# Altium schematic sheet Sheet_1_2024-05-18.schdoc
size 312 x 196 mm
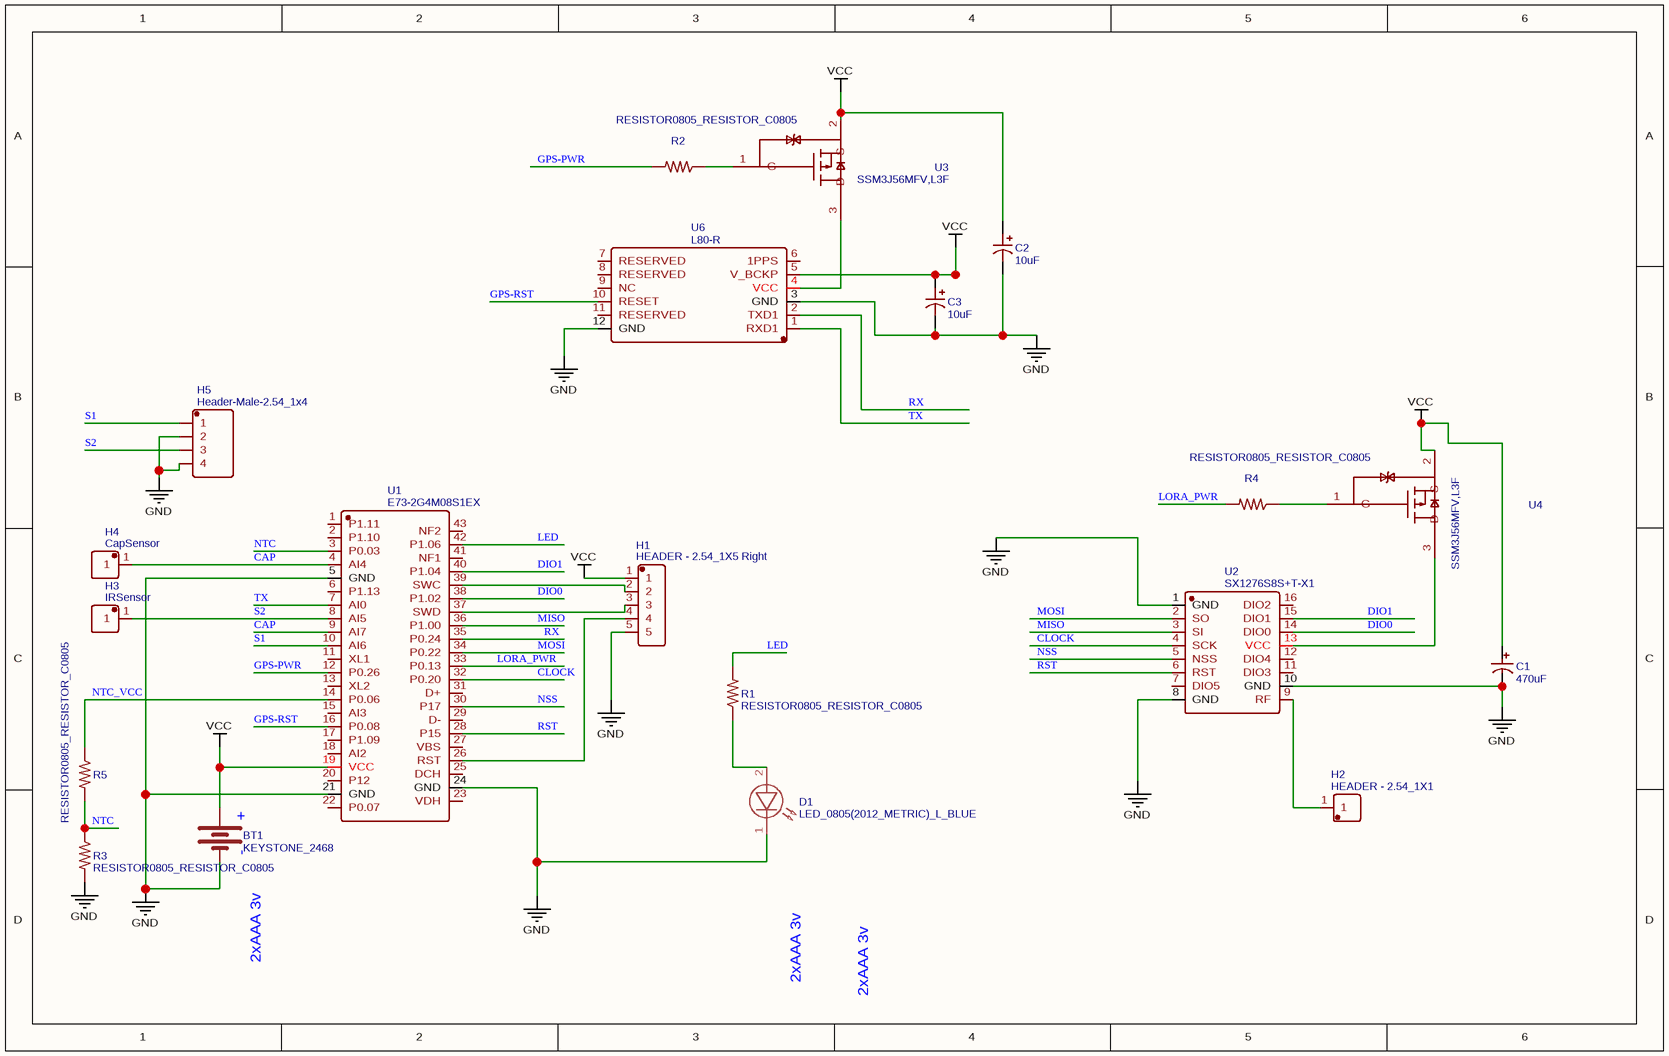
[diagram p0: Sheet_1_2024-05-18.schdoc]

## Parts
BT1  KEYSTONE_2468  [KEYSTONE_2468_2XAAA]
C1  470uF  [CAP-470UF-25V-CHONGX]
C2  10uF  [CAP-SMD_L3.5-W2.8-FD]
C3  10uF  [CAP-SMD_L3.5-W2.8-FD]
D1  LED_0805(2012_METRIC)_L_BLUE  [LED0805_BLUE-1]
H1  HEADER - 2.54_1X5 Right  [HEADER-HEADER-FEMALE-2.54_1X5]
H2  HEADER - 2.54_1X1  [HDR-M-2.54_1X1]
H3  IRSensor  [HDR-M-2.54_1X1]
H4  CapSensor  [HDR-M-2.54_1X1]
H5  Header-Male-2.54_1x4  [HDR-TH_4P-P2.54-V-M]
R1  RESISTOR0805_RESISTOR_C0805  [C0805]
R2  RESISTOR0805_RESISTOR_C0805  [C0805]
R3  RESISTOR0805_RESISTOR_C0805  [C0805]
R4  RESISTOR0805_RESISTOR_C0805  [C0805]
R5  RESISTOR0805_RESISTOR_C0805  [C0805]
U1  E73-2G4M08S1EX  [SMD-43_L18.0-W13.0-P1.27-E73-2G4M08S1E]
U2  SX1276S8S+T-X1  [WIRELM-SMD_SX1278S165SY-T-X1]
U3  SSM3J56MFV,L3F  [SOT-723_L1.2-W0.8-P0.80-LS1.2-BR]
U4  SSM3J56MFV,L3F  [SOT-723_L1.2-W0.8-P0.80-LS1.2-BR]
U6  L80-R  [GPSM-SMD_L80-R]

## Nets
GND: BT1.2(-) C1.2 C2.2 C3.2 D1.1(K) H1.5 H5.2 H5.4 R3.2 U1.5(GND) U1.21(GND) U1.24(GND) U2.1(GND) U2.8(GND) U2.10(GND) U6.3(GND) U6.12(GND)
VCC: BT1.1(+) C1.1 C2.1 C3.1 H1.1 U1.19(VCC) U3.2(S) U4.2(S) U6.5(V_BCKP)
CAP: H4.1 U1.4(AI4) U1.9(AI7)
CLOCK: U1.32(P0.20) U2.4(SCK)
DIO0: U1.38(P1.02) U2.14(DIO0)
DIO1: U1.40(P1.04) U2.15(DIO1)
GPS-PWR: R2.2 U1.12(P0.26)
GPS-RST: U1.16(P0.08) U6.10(RESET)
LED: R1.2 U1.42(P1.06)
LORA_PWR: R4.2 U1.33(P0.13)
MISO: U1.36(P1.00) U2.3(SI)
MOSI: U1.34(P0.22) U2.2(SO)
NSS: U1.30(P17) U2.5(NSS)
NTC: R3.1 R5.2 U1.3(P0.03)
NTC_VCC: R5.1 U1.14(P0.06)
RST: U1.28(P15) U2.6(RST)
RX: U1.35(P0.24) U6.2(TXD1)
S1: H5.1 U1.10(AI6)
S2: H3.1 H5.3 U1.8(AI5)
TX: U1.7(AI0) U6.1(RXD1)
NetD1_2: D1.2(A) R1.1
NetH1_2: H1.2 U1.39(SWC)
NetH1_3: H1.3 U1.37(SWD)
NetH1_4: H1.4 U1.26(RST)
NetH2_1: H2.1 U2.9(RF)
NetR2_1: R2.1 U3.1(G)
NetR4_1: R4.1 U4.1(G)
NetU2_13: U2.13(VCC) U4.3(D)
NetU3_3: U3.3(D) U6.4(VCC)

Not connected (* = marked no-connect by the designer): U1 1(P1.11) 2(P1.10) 6(P1.13) 11(XL1) 13(XL2) 15(AI3) 17(P1.09) 18(AI2) 20(P12) 22(P0.07) 23(VDH) 25(DCH) 27(VBS) 29(D-) 31(D+) 41(NF1) 43(NF2); U2 7(DIO5) 11(DIO3) 12(DIO4) 16(DIO2); U6 6(1PPS) 7(RESERVED) 8(RESERVED) 9(NC) 11(RESERVED)

## Notes on the sheet
- 2xAAA 3v
- (in symbol KEYSTONE_2468) 2xAAA 3v

## Library data of the parts
BT1 = KEYSTONE_2468: Manufacturer Part: 2468; Contributor: a.karnauh; Supplier: LCSC; Supplier Part: 2468; Manufacturer: Keystone; spicePre: B; spiceSymbolName: KEYSTONE_2468
C1 = 470uF: Manufacturer: ValuePro; Manufacturer Part: 470uF 10V白纸 13*25; nameAlias: Capacitance; Contributor: baongoc1234abcd; Supplier: LCSC; Supplier Part: C43814; JLCPCB Part Class: Extended Part; spicePre: C; spiceSymbolName: 470uF 10V ChongX
C2 C3 = 10uF: Manufacturer: CEC(振华新云); Manufacturer Part: CA45-B-10V-10UF-K; nameAlias: Value; Contributor: lcsc; Supplier: LCSC; Supplier Part: C2841149; spicePre: C; spiceSymbolName: CA45-B-10V-10UF-K
D1 = LED_0805(2012_METRIC)_L_BLUE: Contributor: Ілля Бондаренко; spicePre: D; spiceSymbolName: LED_0805(2012_METRIC)_L_BLUE
H1 = HEADER - 2.54_1X5 Right: Contributor: Jonathan Gainsford; spicePre: H; spiceSymbolName: HEADER - 2.54_1X5 Right
H2 = HEADER - 2.54_1X1: Contributor: ASP-29 Tech; Supplier: Private; spicePre: H; spiceSymbolName: HEADER - 2.54_1X1
H3 = IRSensor: Contributor: ASP-29 Tech; Supplier: Private; spicePre: H; spiceSymbolName: HEADER - 2.54_1X1
H4 = CapSensor: Contributor: ASP-29 Tech; Supplier: Private; spicePre: H; spiceSymbolName: HEADER - 2.54_1X1
H5 = Header-Male-2.54_1x4: Manufacturer: Ckmtw(灿科盟); Manufacturer Part: B-2100S04P-A110; Contributor: LCSC; Supplier: LCSC; Supplier Part: C124378; JLCPCB Part Class: Extended Part; spicePre: H; spiceSymbolName: Header-Male-2.54_1x4
R1 = RESISTOR0805_RESISTOR_C0805: Manufacturer: 2.2K; Package Display: No; timeStamp: 1474281357; spicePre: R; spiceSymbolName: RESISTOR0805_RESISTOR_C0805
R2 R4 R5 = RESISTOR0805_RESISTOR_C0805: Manufacturer: 10K; Package Display: No; timeStamp: 1474281357; spicePre: R; spiceSymbolName: RESISTOR0805_RESISTOR_C0805
R3 = RESISTOR0805_RESISTOR_C0805: Manufacturer: NTC 10K; Package Display: No; timeStamp: 1474281357; spicePre: R; spiceSymbolName: RESISTOR0805_RESISTOR_C0805
U1 = E73-2G4M08S1EX: Manufacturer: EBYTE(亿佰特); Contributor: lcsc; Supplier: LCSC; Supplier Part: C2903762; Manufacturer Part: E73-2G4M08S1EX; JLCPCB Part Class: Extended Part; spicePre: U; spiceSymbolName: E73-2G4M08S1EX
U2 = SX1276S8S+T-X1: Manufacturer: Vollgo(沃进); Contributor: LCSC; Supplier: LCSC; Supplier Part: C718834; Manufacturer Part: SX1276S8S+T-X1; JLCPCB Part Class: Extended Part; spicePre: U; spiceSymbolName: SX1276S8S+T-X1
U3 U4 = SSM3J56MFV,L3F: Manufacturer: TOSHIBA(东芝); Contributor: lcsc; Supplier: LCSC; Supplier Part: C5274157; Manufacturer Part: SSM3J56MFV,L3F; JLCPCB Part Class: Extended Part; spicePre: U; spiceSymbolName: SSM3J56MFV,L3F
U6 = L80-R: Manufacturer: Quectel(移远); Contributor: LCSC; Supplier: LCSC; Supplier Part: C188357; Manufacturer Part: L80-R; JLCPCB Part Class: Extended Part; spicePre: U; spiceSymbolName: L80-R